# EAGLE schematic CntrlBoard (EAGLE 6.5.0)
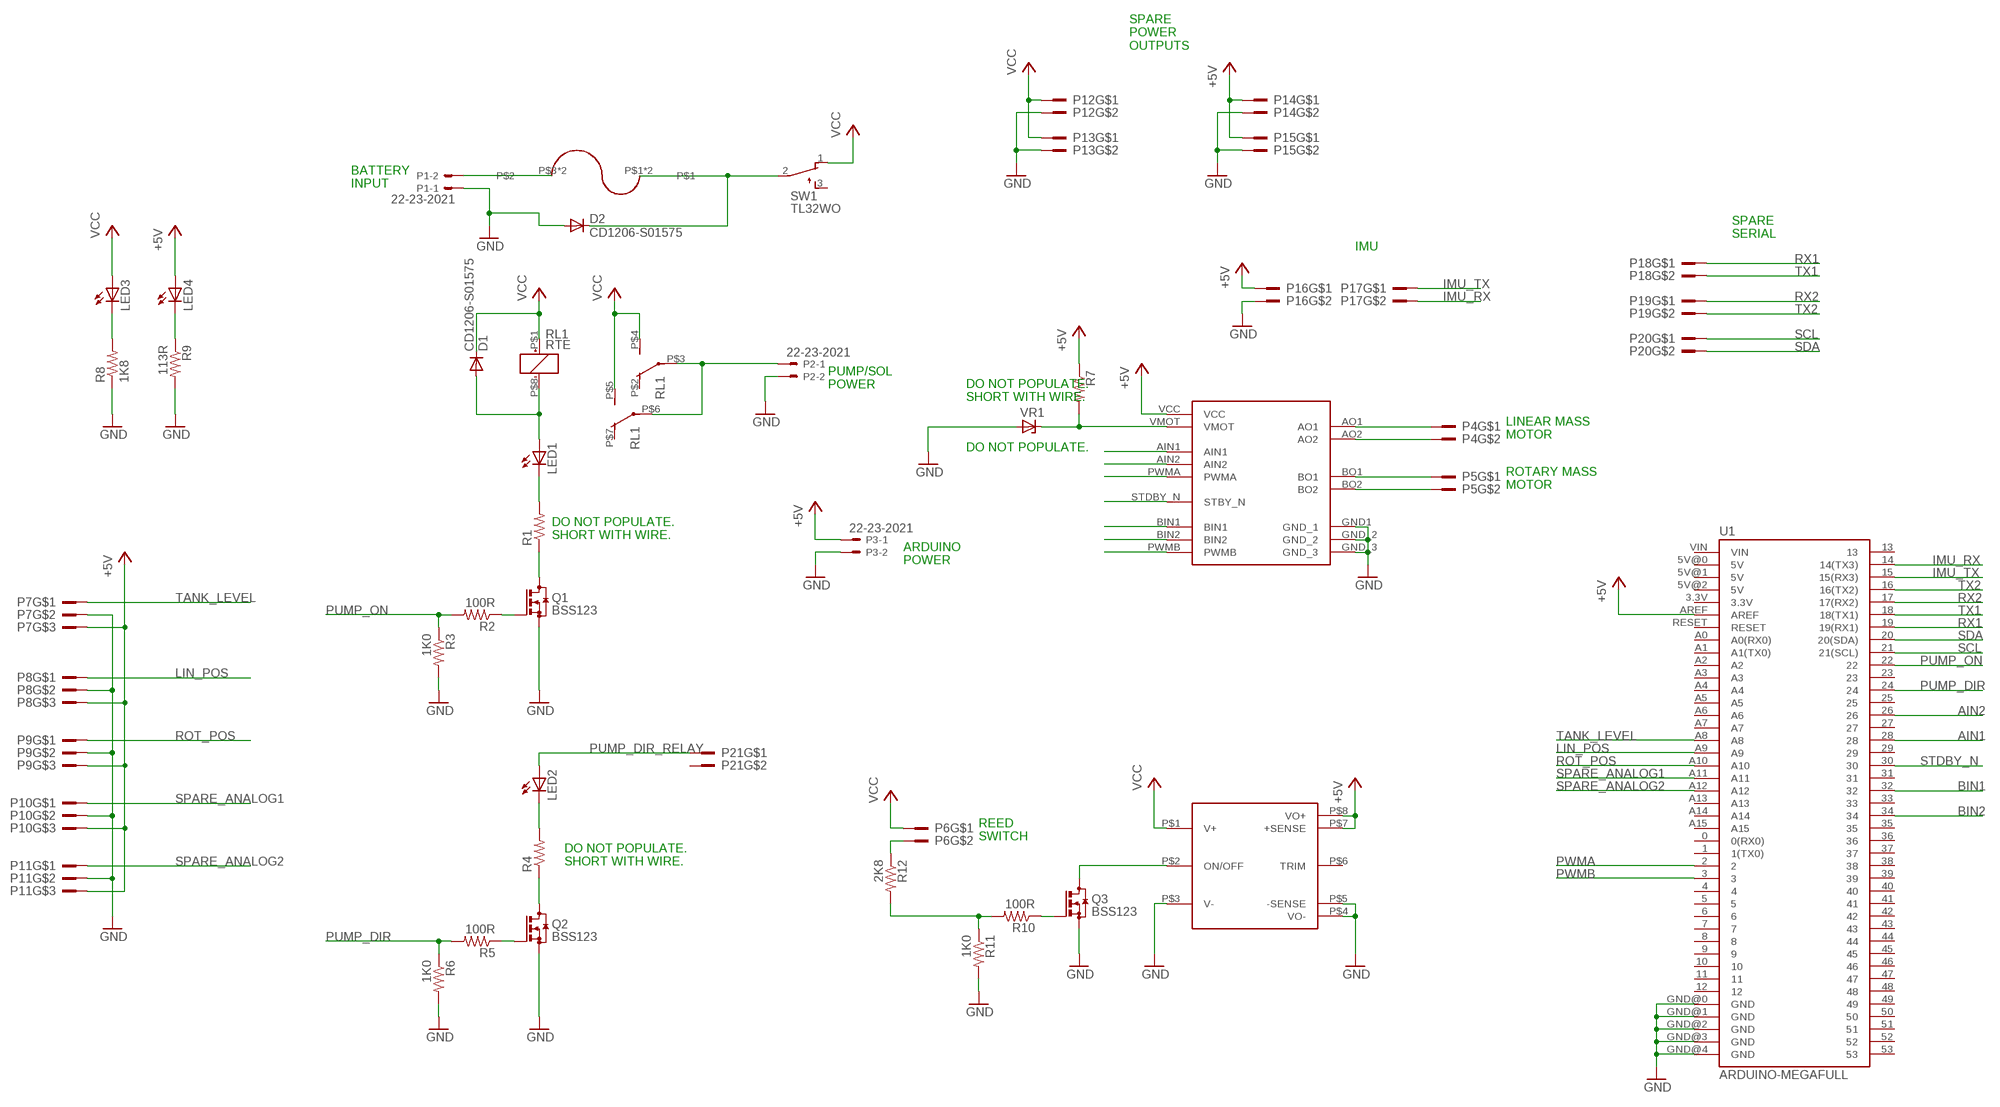
[diagram p0: schematic, sheet 1]

## Parts
D1  CD1206-S01575  [CD1206]
D2  CD1206-S01575  [CD1206]
LED1  LEDCHIPLED_1206  [CHIPLED_1206]
LED2  LEDCHIPLED_1206  [CHIPLED_1206]
LED3  LEDCHIPLED_1206  [CHIPLED_1206]
LED4  LEDCHIPLED_1206  [CHIPLED_1206]
P1  22-23-2021  [22-23-2021]
P2  22-23-2021  [22-23-2021]
P3  22-23-2021  [22-23-2021]
P4  DF3A-2P-2DSA  [DF3A-2P-2DSA]
P5  DF3A-2P-2DSA  [DF3A-2P-2DSA]
P6  DF3A-2P-2DSA  [DF3A-2P-2DSA]
P7  3PIN2MMPITCH  [3PIN_2MMPITCH]
P8  3PIN2MMPITCH  [3PIN_2MMPITCH]
P9  3PIN2MMPITCH  [3PIN_2MMPITCH]
P10  3PIN2MMPITCH  [3PIN_2MMPITCH]
P11  3PIN2MMPITCH  [3PIN_2MMPITCH]
P12  DF3A-2P-2DSA  [DF3A-2P-2DSA]
P13  DF3A-2P-2DSA  [DF3A-2P-2DSA]
P14  DF3A-2P-2DSA  [DF3A-2P-2DSA]
P15  DF3A-2P-2DSA  [DF3A-2P-2DSA]
P16  DF3A-2P-2DSA  [DF3A-2P-2DSA]
P17  DF3A-2P-2DSA  [DF3A-2P-2DSA]
P18  DF3A-2P-2DSA  [DF3A-2P-2DSA]
P19  DF3A-2P-2DSA  [DF3A-2P-2DSA]
P20  DF3A-2P-2DSA  [DF3A-2P-2DSA]
P21  DF3A-2P-2DSA  [DF3A-2P-2DSA]
PS1  KHHD006A0A41Z  [KHHD006A0A41Z]
Q1  BSS123  [SOT23]
Q2  BSS123  [SOT23]
Q3  BSS123  [SOT23]
R1  R-US_R1206  [R1206]
R2  100R  R-US_R1206  [R1206]
R3  1K0  R-US_R1206  [R1206]
R4  R-US_R1206  [R1206]
R5  100R  R-US_R1206  [R1206]
R6  1K0  R-US_R1206  [R1206]
R7  R-US_R1206  [R1206]
R8  1K8  R-US_R1210  [R1210]
R9  113R  R-US_R1206  [R1206]
R10  100R  R-US_R1206  [R1206]
R11  1K0  R-US_R1206  [R1206]
R12  2K8  R-US_R1206  [R1206]
RL1  RTE  [RTE]
SW1  TL32WO  [TL3XWO]
U1  ARDUINO-MEGAFULL  [ARDUINO_MEGA]
U$1  ATC_FUSE_HOLDER  [FUSE_HOLDER_ATC]
U$2  POLOLU713  [POLOLU713]
VR1  ZENER-DIODESOT23  [SOT23]

## Nets
+5V: LED4.A P3.1 P7.P$3 P8.P$3 P9.P$3 P10.P$3 P11.P$3 P14.P$1 P15.P$1 P16.P$1 PS1.P$7(+SENSE) PS1.P$8(VO+) R7.1 U1.AREF U$2.VCC
AIN1: U1.28 U$2.AIN1
AIN2: U1.26 U$2.AIN2
BIN1: U1.32 U$2.BIN1
BIN2: U1.34 U$2.BIN2
GND: D2.A P1.1 P2.2 P3.2 P7.P$2 P8.P$2 P9.P$2 P10.P$2 P11.P$2 P12.P$2 P13.P$2 P14.P$2 P15.P$2 P16.P$2 PS1.P$3(V-) PS1.P$4(VO-) PS1.P$5(-SENSE) Q1.2(S) Q2.2(S) Q3.2(S) R3.2 R6.2 R8.1 R9.2 R11.2 U1.GND@0(GND) U1.GND@1(GND) U1.GND@2(GND) U1.GND@3(GND) U1.GND@4(GND) U$2.GND1(GND_1) U$2.GND_2 U$2.GND_3 VR1.1(A)
IMU_RX: P17.P$2 U1.14(14(TX3))
IMU_TX: P17.P$1 U1.15(15(RX3))
LIN_POS: P8.P$1 U1.A9
N$1: P1.2 U$1.P$3 U$1.P$4
N$2: D1.A LED1.A RL1.P$8(-)
N$3: D2.K(C) SW1.2(P) U$1.P$1 U$1.P$2
N$4: P2.1 RL1.P$3(P) RL1.P$6(P)
N$5: LED1.C R1.2
N$6: Q1.3(D) R1.1
N$7: Q2.3(D) R4.1
N$8: Q1.1(G) R2.1
N$9: LED2.C R4.2
N$10: LED4.C R9.1
N$11: Q2.1(G) R5.1
N$12: LED3.C R8.2
N$13: R10.2 R11.1 R12.2
N$14: Q3.1(G) R10.1
N$15: P6.P$2 R12.1
N$16: PS1.P$2(ON/OFF) Q3.3(D)
N$17: P4.P$1 U$2.AO1
N$18: P4.P$2 U$2.AO2
N$19: P5.P$1 U$2.BO1
N$20: P5.P$2 U$2.BO2
N$21: R7.2 U$2.VMOT VR1.3(C)
PUMP_DIR: R5.2 R6.1 U1.24
PUMP_DIR_RELAY: LED2.A P21.P$1
PUMP_ON: R2.2 R3.1 U1.22
PWMA: U1.2 U$2.PWMA
PWMB: U1.3 U$2.PWMB
ROT_POS: P9.P$1 U1.A10
RX1: P18.P$1 U1.19(19(RX1))
RX2: P19.P$1 U1.17(17(RX2))
SCL: P20.P$1 U1.21(21(SCL))
SDA: P20.P$2 U1.20(20(SDA))
SPARE_ANALOG1: P10.P$1 U1.A11
SPARE_ANALOG2: P11.P$1 U1.A12
STDBY_N: U1.30 U$2.STDBY_N(STBY_N)
TANK_LEVEL: P7.P$1 U1.A8
TX1: P18.P$2 U1.18(18(TX1))
TX2: P19.P$2 U1.16(16(TX2))
VCC: D1.K(C) LED3.A P6.P$1 P12.P$1 P13.P$1 PS1.P$1(V+) RL1.P$1(+) RL1.P$4(S) RL1.P$5(S) SW1.1(O)
Unconnected: P21.P$2 PS1.P$6(TRIM) RL1.P$2(O) RL1.P$7(O) SW1.3(S) U1.0(0(RX0)) U1.1(1(TX0)) U1.3.3V U1.4 U1.5 U1.5V@0(5V) U1.5V@1(5V) U1.5V@2(5V) U1.6 U1.7 U1.8 U1.9 U1.10 U1.11 U1.12 U1.13 U1.23 U1.25 U1.27 U1.29 U1.31 U1.33 U1.35 U1.36 U1.37 U1.38 U1.39 U1.40 U1.41 U1.42 U1.43 U1.44 U1.45 U1.46 U1.47 U1.48 U1.49 U1.50 U1.51 U1.52 U1.53 U1.A0(A0(RX0)) U1.A1(A1(TX0)) U1.A2 U1.A3 U1.A4 U1.A5 U1.A6 U1.A7 U1.A13 U1.A14 U1.A15 U1.RESET U1.VIN

## Notes on the sheet
- SPARE
  POWER
  OUTPUTS
- BATTERY
  INPUT
- SPARE
  SERIAL
- IMU
- PUMP/SOL
  POWER
- DO NOT POPULATE.
  SHORT WITH WIRE.
- LINEAR MASS
  MOTOR
- DO NOT POPULATE.
- ROTARY MASS
  MOTOR
- DO NOT POPULATE.
  SHORT WITH WIRE.
- ARDUINO
  POWER
- REED
  SWITCH
- DO NOT POPULATE.
  SHORT WITH WIRE.

## Library data of the parts
D1 D2 = diode:CD1206-S01575
LED1-LED4 = led:LED: LED OSRAM: - CHIPLED LG R971, LG N971, LY N971, LG Q971, LY Q971, LO R971, LY R971 LH N974, LH R974 LS Q976, LO Q976, LY Q976 LO Q996 - Hyper CHIPLED LW Q18S LB Q993, LB Q99A, LB R99A - SideLED LS A670, LO A670, LY A670, LG A670, LP A670 LB A673, LV A673, LT A673, LW A673 LH A674 LY A675 LS A676, LA A676, LO A676, LY A676, LW A676 LS A679, LY A679, LG A679 - Hyper Micro SIDELED® LS Y876, LA Y876, LO Y876, LY Y876 LT Y87S - SmartLED LW L88C, LW L88S LB L89C, LB L89S, LG L890 LS L89K, LO L89K, LY L89K LS L896, LA L896, LO L896, LY L896 - TOPLED LS T670, LO T670, LY T670, LG T670, LP T670 LSG T670, LSP T670, LSY T670, LOP T670, LYG T670 LG T671, LOG T671, LSG T671 LB T673, LV T673, LT T673, LW T673 LH T674 LS T676, LA T676, LO T676, LY T676, LB T676, LH T676, LSB T676, LW T676 LB T67C, LV T67C, LT T67C, LS T67K, LO T67K, LY T67K, LW E67C LS E67B, LA E67B, LO E67B, LY E67B, LB E67C, LV E67C, LT E67C LW T67C LS T679, LY T679, LG T679 LS T770, LO T770, LY T770, LG T770, LP T770 LB T773, LV T773, LT T773, LW T773 LH T774 LS E675, LA E675, LY E675, LS T675 LS T776, LA T776, LO T776, LY T776, LB T776 LHGB T686 LT T68C, LB T68C - Hyper Mini TOPLED® LB M676 - Mini TOPLED Santana® LG M470 LS M47K, LO M47K, LY M47K Source: http://www.osram.convergy.de LUXEON: - LUMILED® LXK2-PW12-R00, LXK2-PW12-S00, LXK2-PW14-U00, LXK2-PW14-V00 LXK2-PM12-R00, LXK2-PM12-S00, LXK2-PM14-U00 LXK2-PE12-Q00, LXK2-PE12-R00, LXK2-PE12-S00, LXK2-PE14-T00, LXK2-PE14-U00 LXK2-PB12-K00, LXK2-PB12-L00, LXK2-PB12-M00, LXK2-PB14-N00, LXK2-PB14-P00, LXK2-PB14-Q00 LXK2-PR12-L00, LXK2-PR12-M00, LXK2-PR14-Q00, LXK2-PR14-R00 LXK2-PD12-Q00, LXK2-PD12-R00, LXK2-PD12-S00 LXK2-PH12-R00, LXK2-PH12-S00 LXK2-PL12-P00, LXK2-PL12-Q00, LXK2-PL12-R00 Source: www.luxeon.com KINGBRIGHT: KA-3528ASYC Source: www.kingbright.com
P1-P3 = con-molex:22-23-2021: .100" (2.54mm) Center Header - 2 Pin; MF: MOLEX; MPN: 22-23-2021; OC_FARNELL: 1462926; OC_NEWARK: 25C3832
P4-P6 P12-P21 = con-3m:DF3A-2P-2DSA
P7-P11 = con-3m:3PIN2MMPITCH
PS1 = dc-dc-converter:KHHD006A0A41Z
Q1-Q3 = transistor-small-signal:BSS123: N-CHANNEL MOS FET
R1-R12 = resistor:R-US_: RESISTOR, American symbol
RL1 = relay:RTE
SW1 = switch:TL32WO: TINY SWITCH ON - MOM Source: http://www2.produktinfo.conrad.com/datenblaetter/700000-724999/705152-da-01-de-Subminiaturschalter_TL_36WO.pdf
U1 = SparkFun-Boards:ARDUINO-MEGA: Arduino Mega board footprint
U$1 = fuse:ATC_FUSE_HOLDER
U$2 = adafruit:POLOLU713
VR1 = diode:ZENER-DIODE: Z-Diode